# Altium schematic sheet RHD2164_USBC.SchDoc
size Tabloid; SheetNumber: 1; SheetTotal: 1; Sheet_Name: Insert name in Document Parameters; Size: 11x17
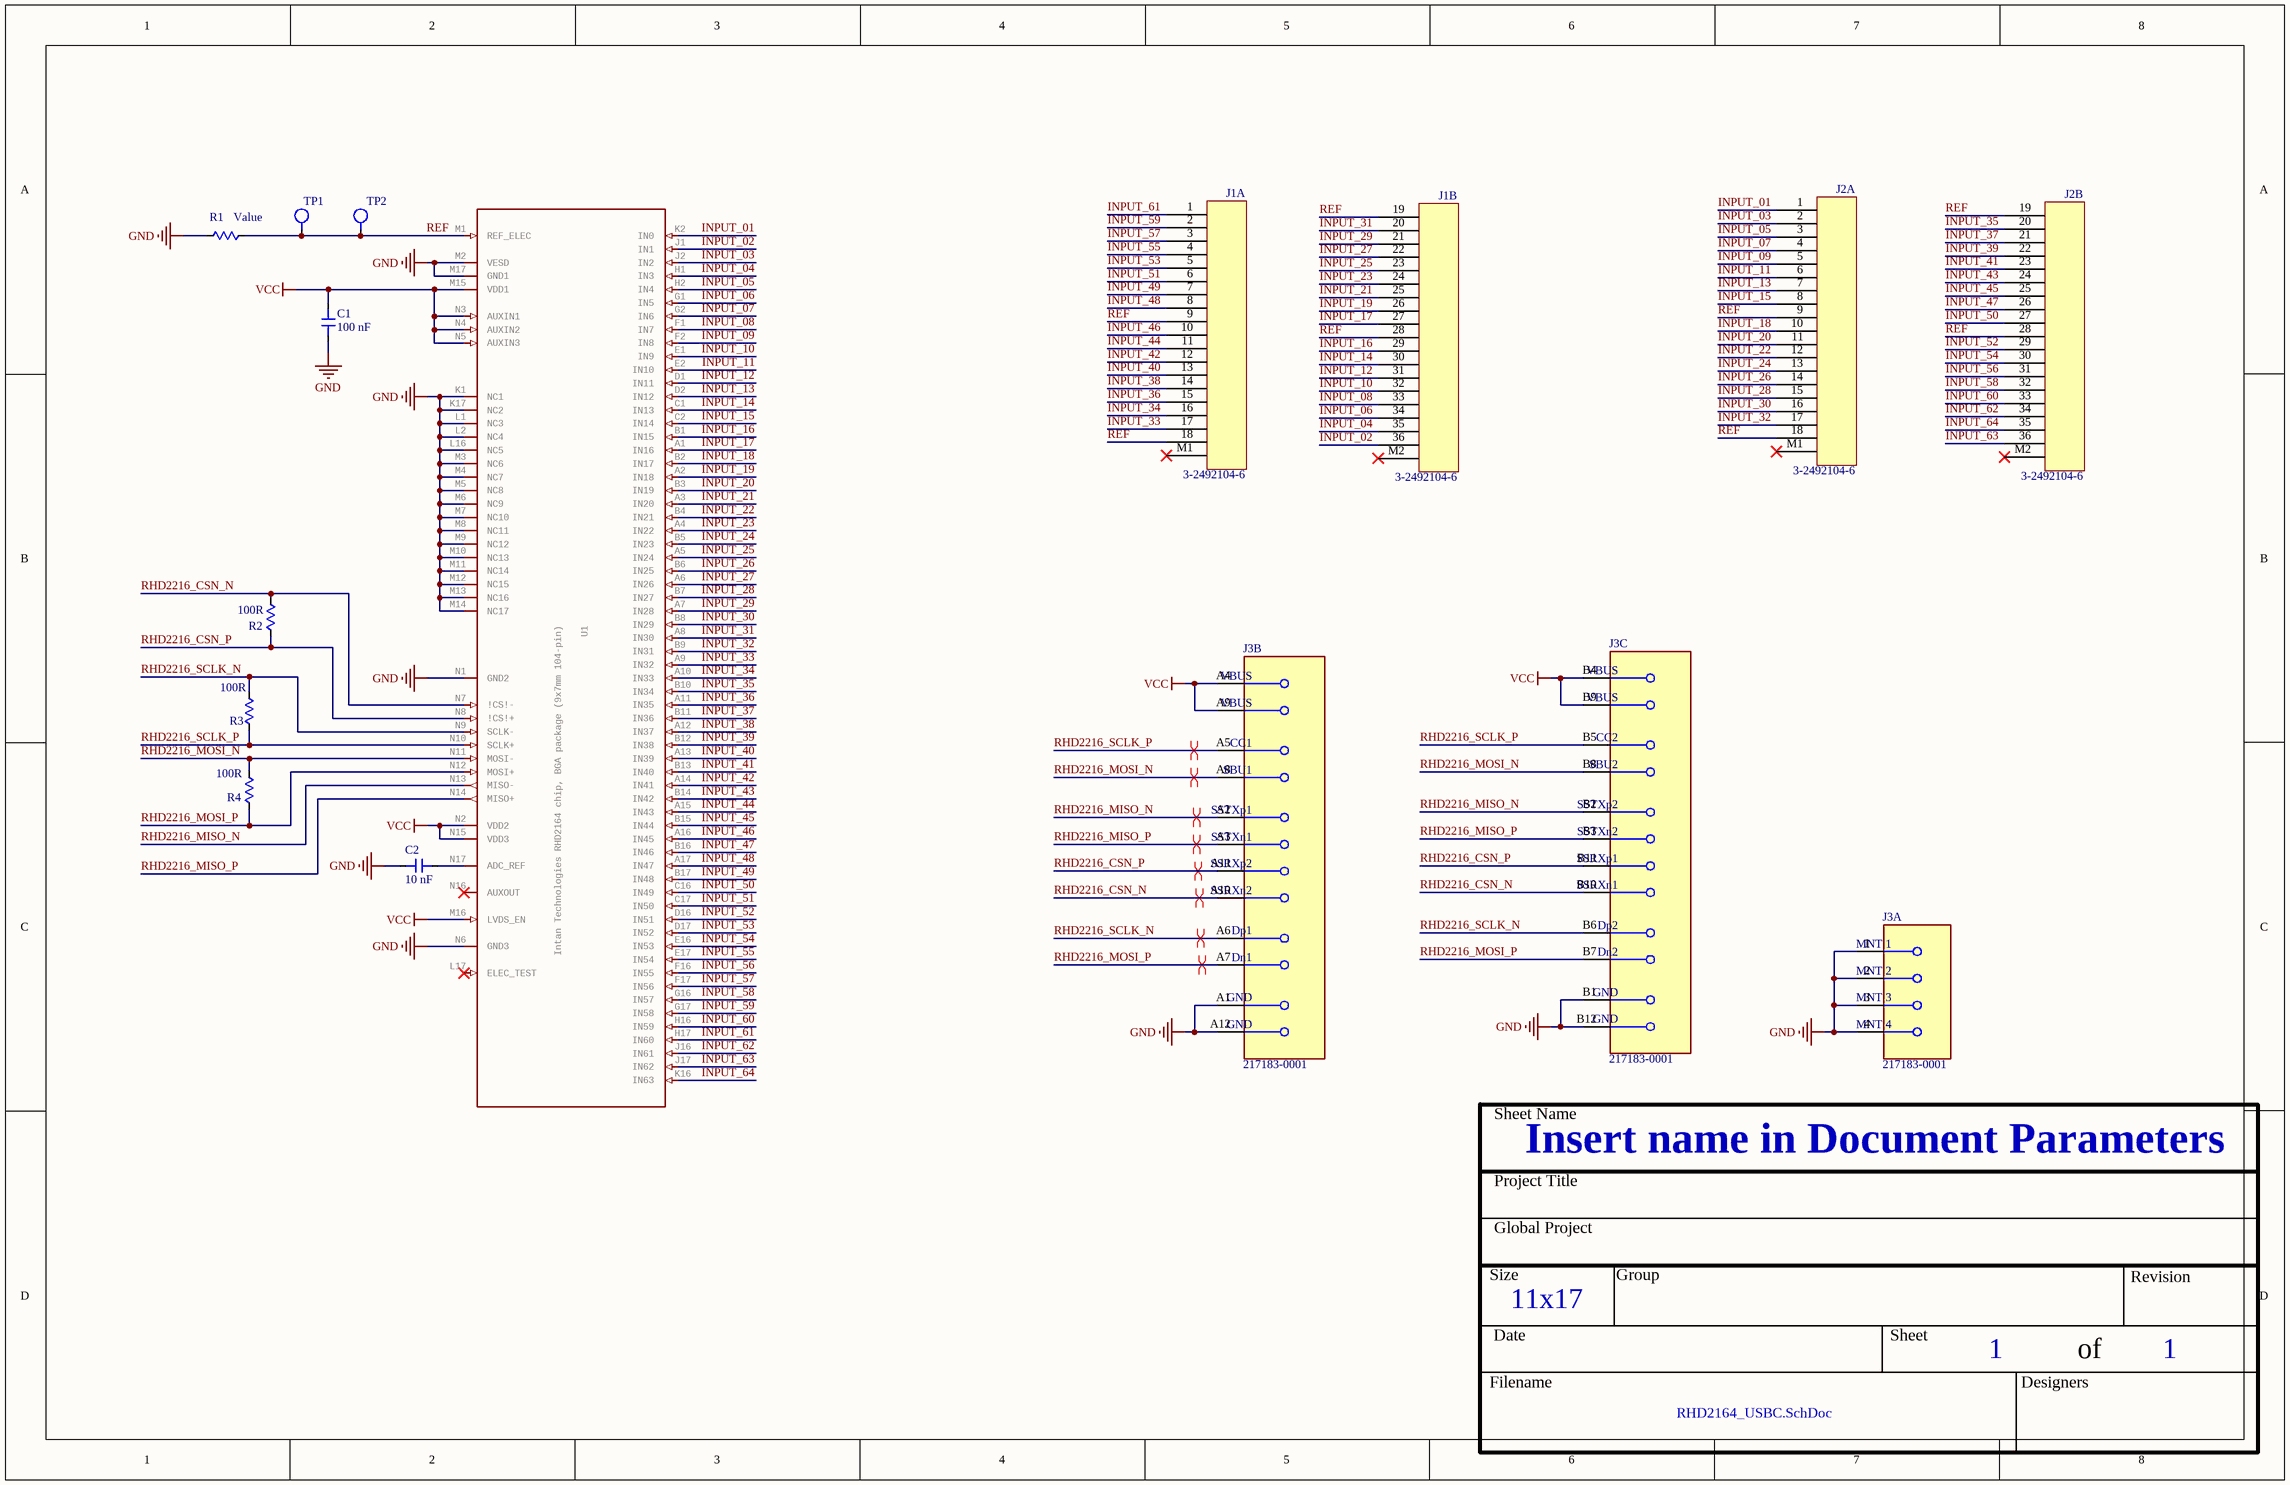
[diagram p0: RHD2164_USBC.SchDoc]

## Parts
C1  100 nF  [0402_CAPACITOR]
C2  10 nF  [0402_CAPACITOR]
J1  3-2492104-6  [CON_ZIF_RA_36POS]  (parts A,B of 2)
J2  3-2492104-6  [CON_ZIF_RA_36POS]  (parts A,B of 2)
J3  217183-0001  [FP-217183-0001-MFG]  (parts A,B,C of 3)
R1  Value  [0402_Resistor]
R2  100R  [0402_Resistor]
R3  100R  [0402_Resistor]
R4  100R  [0402_Resistor]
TP1  TP_Small  [TP_Small_M2]  (value not drawn)
TP2  TP_Small  [TP_Small_M2]  (value not drawn)
U1  Intan Technologies RHD2164 chip, BGA package (9x7mm 104-pin)  [RHD2164_BGA]

## Nets
GND: C1.1 C2.2 J3.1(MNT_1) J3.2(MNT_2) J3.3(MNT_3) J3.4(MNT_4) J3.A1(GND) J3.A12(GND) J3.B1(GND) J3.B12(GND) R1.1 U1.K1(NC1) U1.K17(NC2) U1.L1(NC3) U1.L2(NC4) U1.L16(NC5) U1.M2(VESD) U1.M3(NC6) U1.M4(NC7) U1.M5(NC8) U1.M6(NC9) U1.M7(NC10) U1.M8(NC11) U1.M9(NC12) U1.M10(NC13) U1.M11(NC14) U1.M12(NC15) U1.M13(NC16) U1.M14(NC17) U1.M17(GND1) U1.N1(GND2) U1.N6(GND3)
VCC: C1.2 J3.A4(VBUS) J3.A9(VBUS) J3.B4(VBUS) J3.B9(VBUS) U1.M15(VDD1) U1.M16(LVDS_EN) U1.N2(VDD2) U1.N3(AUXIN1) U1.N4(AUXIN2) U1.N5(AUXIN3) U1.N15(VDD3)
INPUT_01: J2.1 U1.K2(IN0)
INPUT_02: J1.36 U1.J1(IN1)
INPUT_03: J2.2 U1.J2(IN2)
INPUT_04: J1.35 U1.H1(IN3)
INPUT_05: J2.3 U1.H2(IN4)
INPUT_06: J1.34 U1.G1(IN5)
INPUT_07: J2.4 U1.G2(IN6)
INPUT_08: J1.33 U1.F1(IN7)
INPUT_09: J2.5 U1.F2(IN8)
INPUT_10: J1.32 U1.E1(IN9)
INPUT_11: J2.6 U1.E2(IN10)
INPUT_12: J1.31 U1.D1(IN11)
INPUT_13: J2.7 U1.D2(IN12)
INPUT_14: J1.30 U1.C1(IN13)
INPUT_15: J2.8 U1.C2(IN14)
INPUT_16: J1.29 U1.B1(IN15)
INPUT_17: J1.27 U1.A1(IN16)
INPUT_18: J2.10 U1.B2(IN17)
INPUT_19: J1.26 U1.A2(IN18)
INPUT_20: J2.11 U1.B3(IN19)
INPUT_21: J1.25 U1.A3(IN20)
INPUT_22: J2.12 U1.B4(IN21)
INPUT_23: J1.24 U1.A4(IN22)
INPUT_24: J2.13 U1.B5(IN23)
INPUT_25: J1.23 U1.A5(IN24)
INPUT_26: J2.14 U1.B6(IN25)
INPUT_27: J1.22 U1.A6(IN26)
INPUT_28: J2.15 U1.B7(IN27)
INPUT_29: J1.21 U1.A7(IN28)
INPUT_30: J2.16 U1.B8(IN29)
INPUT_31: J1.20 U1.A8(IN30)
INPUT_32: J2.17 U1.B9(IN31)
INPUT_33: J1.17 U1.A9(IN32)
INPUT_34: J1.16 U1.A10(IN33)
INPUT_35: J2.20 U1.B10(IN34)
INPUT_36: J1.15 U1.A11(IN35)
INPUT_37: J2.21 U1.B11(IN36)
INPUT_38: J1.14 U1.A12(IN37)
INPUT_39: J2.22 U1.B12(IN38)
INPUT_40: J1.13 U1.A13(IN39)
INPUT_41: J2.23 U1.B13(IN40)
INPUT_42: J1.12 U1.A14(IN41)
INPUT_43: J2.24 U1.B14(IN42)
INPUT_44: J1.11 U1.A15(IN43)
INPUT_45: J2.25 U1.B15(IN44)
INPUT_46: J1.10 U1.A16(IN45)
INPUT_47: J2.26 U1.B16(IN46)
INPUT_48: J1.8 U1.A17(IN47)
INPUT_49: J1.7 U1.B17(IN48)
INPUT_50: J2.27 U1.C16(IN49)
INPUT_51: J1.6 U1.C17(IN50)
INPUT_52: J2.29 U1.D16(IN51)
INPUT_53: J1.5 U1.D17(IN52)
INPUT_54: J2.30 U1.E16(IN53)
INPUT_55: J1.4 U1.E17(IN54)
INPUT_56: J2.31 U1.F16(IN55)
INPUT_57: J1.3 U1.F17(IN56)
INPUT_58: J2.32 U1.G16(IN57)
INPUT_59: J1.2 U1.G17(IN58)
INPUT_60: J2.33 U1.H16(IN59)
INPUT_61: J1.1 U1.H17(IN60)
INPUT_62: J2.34 U1.J16(IN61)
INPUT_63: J2.36 U1.J17(IN62)
INPUT_64: J2.35 U1.K16(IN63)
REF: J1.9 J1.18 J1.19 J1.28 J2.9 J2.18 J2.19 J2.28 R1.2 TP1.1 TP2.1 U1.M1(REF_ELEC)
RHD2216_CSN_N: J3.A10(SSRXn2) J3.B10(SSRXn1) R2.2 U1.N7(!CS!-)
RHD2216_CSN_P: J3.A11(SSRXp2) J3.B11(SSRXp1) R2.1 U1.N8(!CS!+)
RHD2216_MISO_N: J3.A2(SSTXp1) J3.B2(SSTXp2) U1.N13(MISO-)
RHD2216_MISO_P: J3.A3(SSTXn1) J3.B3(SSTXn2) U1.N14(MISO+)
RHD2216_MOSI_N: J3.A8(SBU1) J3.B8(SBU2) R4.2 U1.N11(MOSI-)
RHD2216_MOSI_P: J3.A7(Dn1) J3.B7(Dn2) R4.1 U1.N12(MOSI+)
RHD2216_SCLK_N: J3.A6(Dp1) J3.B6(Dp2) R3.2 U1.N9(SCLK-)
RHD2216_SCLK_P: J3.A5(CC1) J3.B5(CC2) R3.1 U1.N10(SCLK+)
NetC2_1: C2.1 U1.N17(ADC_REF)

Not connected (* = marked no-connect by the designer): J1 M1* M2*; J2 M1* M2*; U1 L17(ELEC_TEST)* N16(AUXOUT)*

## Layout directives
differential pair: RHD2216_CSN_N, RHD2216_CSN_P, RHD2216_MISO_N, RHD2216_MISO_P, RHD2216_MOSI_N, RHD2216_MOSI_P, RHD2216_SCLK_N, RHD2216_SCLK_P

## Notes on the sheet
- Sheet Name
- Project Title
- Global Project
- Size
- Group
- Revision
- Date
- Sheet
- of
- Filename
- Designers

## Library data of the parts
C1 C2 = Capacitor
J1 J2 = CON_ZIF_RA_36POS: 36 Position FPC Connector Contacts, Bottom 0.020" (0.50mm) Surface Mount, Right Angle; GRAMS Lib Spec: 2.7
J3 = CON_USBC_TH_SMT: USB-C (USB TYPE-C) USB 3.2 Gen 1 (USB 3.1 Gen 1, Superspeed (USB 3.0)) Receptacle Connector 24 Position Through Hole, Right Angle
R1-R4 = Resistor: GRAMS Lib Spec: 2.7
U1 = RHD2164_BGA_BGA: GateName_1: A; DeviceName: _BGA; SymbolName_1: RHD2164_BGA; LibraryName: RHD2000; DeviceSetName: RHD2164_BGA; Package: BGA104_9X7